# Altium project OneWireTC.PrjPcb
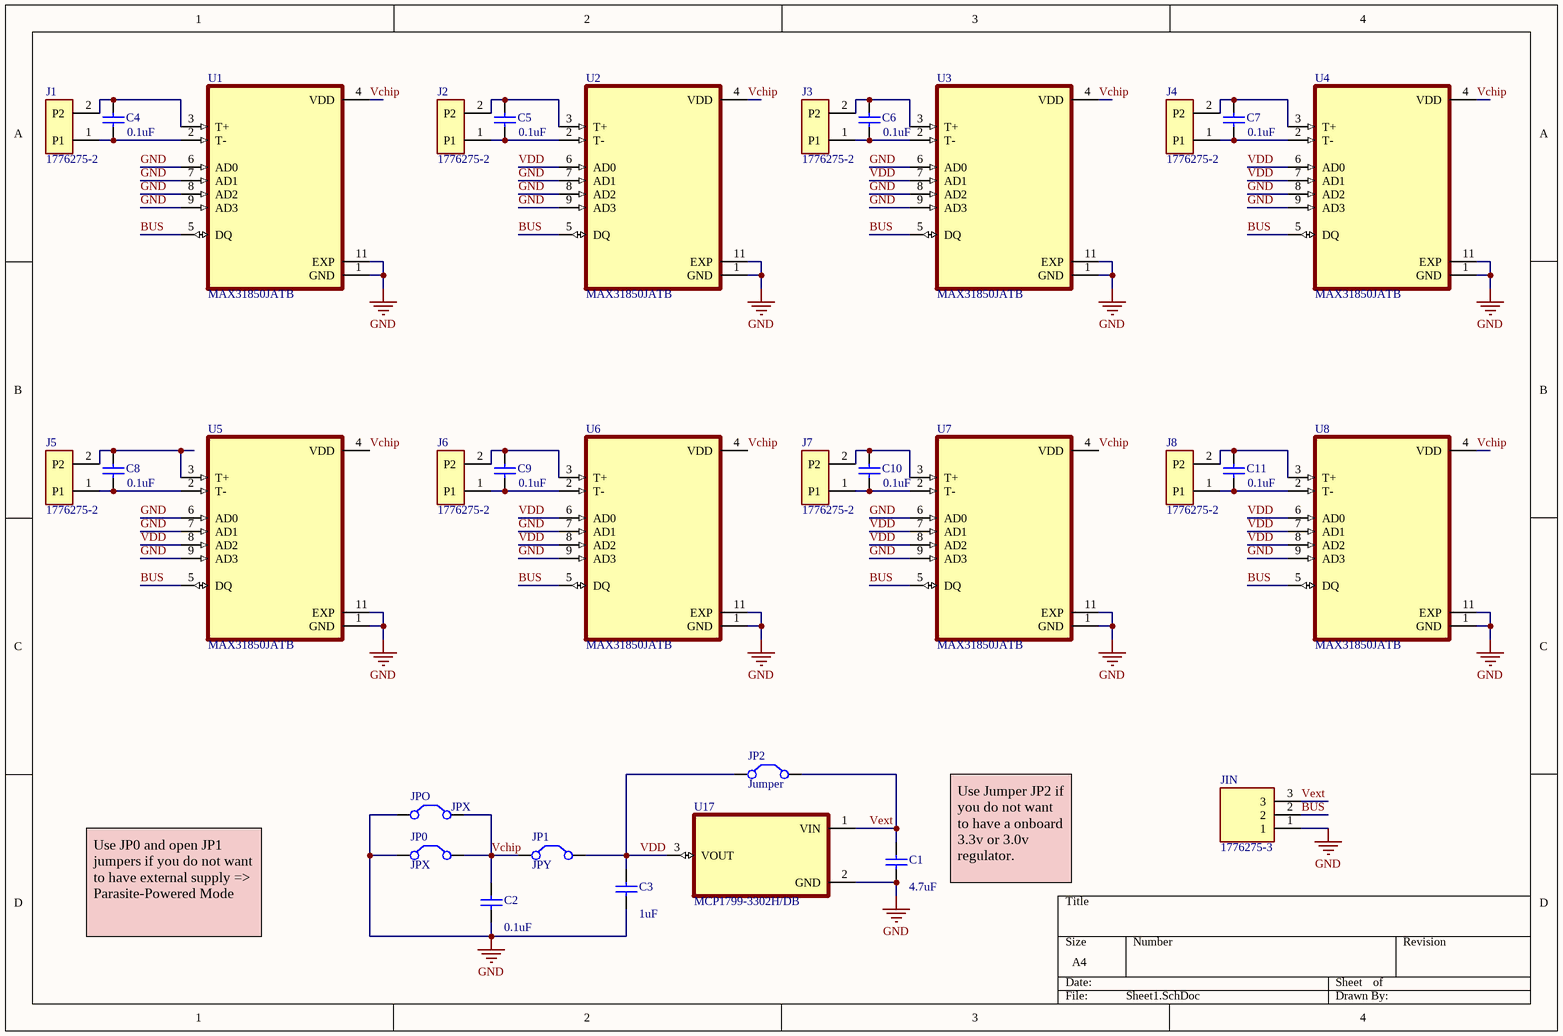
[diagram p0: Sheet1.SchDoc]
2 sheets, 57 parts. Net scope: global (net labels, ports and power ports of the same name join across sheets).
Board file: OneWireTC.PcbDoc
Sheets:
  Sheet1.SchDoc
  Sheet2.SchDoc

## Sheet Sheet1.SchDoc
size A4

### Parts
C1  value 4.7uF  [C0805]
C2  value 0.1uF  [1608[0603]]
C3  value 1uF  [1608[0603]]
C4  value 0.1uF  [1608[0603]]
C5  value 0.1uF  [1608[0603]]
C6  value 0.1uF  [1608[0603]]
C7  value 0.1uF  [1608[0603]]
C8  value 0.1uF  [1608[0603]]
C9  value 0.1uF  [1608[0603]]
C10  value 0.1uF  [1608[0603]]
C11  value 0.1uF  [1608[0603]]
J1  1776275-2  [TE_1776275-2]
J2  1776275-2  [TE_1776275-2]
J3  1776275-2  [TE_1776275-2]
J4  1776275-2  [TE_1776275-2]
J5  1776275-2  [TE_1776275-2]
J6  1776275-2  [TE_1776275-2]
J7  1776275-2  [TE_1776275-2]
J8  1776275-2  [TE_1776275-2]
JIN  1776275-3  [TE_1776275-3]
JP0  JPX  [1608[0603]]
JP1  JPY  [6-0805_L]
JP2  Jumper  [6-0805_L]
JPO  JPX  [1608[0603]]
U1  MAX31850JATB  [SON50P300X400X80-11N]
U2  MAX31850JATB  [SON50P300X400X80-11N]
U3  MAX31850JATB  [SON50P300X400X80-11N]
U4  MAX31850JATB  [SON50P300X400X80-11N]
U5  MAX31850JATB  [SON50P300X400X80-11N]
U6  MAX31850JATB  [SON50P300X400X80-11N]
U7  MAX31850JATB  [SON50P300X400X80-11N]
U8  MAX31850JATB  [SON50P300X400X80-11N]
U17  MCP1799-3302H/DB  [SOT230P700X180-4N]

### Nets
GND: C1.1 C2.1 C3.1 JIN.1 JP0.1(C1) JPO.1(C1) U1.1(GND) U1.6(AD0) U1.7(AD1) U1.8(AD2) U1.9(AD3) U1.11(EXP) U2.1(GND) U2.7(AD1) U2.8(AD2) U2.9(AD3) U2.11(EXP) U3.1(GND) U3.6(AD0) U3.8(AD2) U3.9(AD3) U3.11(EXP) U4.1(GND) U4.8(AD2) U4.9(AD3) U4.11(EXP) U5.1(GND) U5.6(AD0) U5.7(AD1) U5.9(AD3) U5.11(EXP) U6.1(GND) U6.7(AD1) U6.9(AD3) U6.11(EXP) U7.1(GND) U7.6(AD0) U7.9(AD3) U7.11(EXP) U8.1(GND) U8.9(AD3) U8.11(EXP) U17.2(GND)
BUS: JIN.2 U1.5(DQ) U2.5(DQ) U3.5(DQ) U4.5(DQ) U5.5(DQ) U6.5(DQ) U7.5(DQ) U8.5(DQ)
Vchip: C2.2 JP0.2(C2) JP1.1(C1) JPO.2(C2) U1.4(VDD) U2.4(VDD) U3.4(VDD) U4.4(VDD) U5.4(VDD) U6.4(VDD) U7.4(VDD) U8.4(VDD)
VDD: C3.2 JP1.2(C2) JP2.1(C1) U2.6(AD0) U3.7(AD1) U4.6(AD0) U4.7(AD1) U5.8(AD2) U6.6(AD0) U6.8(AD2) U7.7(AD1) U7.8(AD2) U8.6(AD0) U8.7(AD1) U8.8(AD2) U17.3(VOUT)
Vext: C1.2 JIN.3 JP2.2(C2) U17.1(VIN)
NetC4_1: C4.1 J1.1(P1) U1.2(T-)
NetC4_2: C4.2 J1.2(P2) U1.3(T+)
NetC5_1: C5.1 J2.1(P1) U2.2(T-)
NetC5_2: C5.2 J2.2(P2) U2.3(T+)
NetC6_1: C6.1 J3.1(P1) U3.2(T-)
NetC6_2: C6.2 J3.2(P2) U3.3(T+)
NetC7_1: C7.1 J4.1(P1) U4.2(T-)
NetC7_2: C7.2 J4.2(P2) U4.3(T+)
NetC8_1: C8.1 J5.1(P1) U5.2(T-)
NetC8_2: C8.2 J5.2(P2) U5.3(T+)
NetC9_1: C9.1 J6.1(P1) U6.2(T-)
NetC9_2: C9.2 J6.2(P2) U6.3(T+)
NetC10_1: C10.1 J7.1(P1) U7.2(T-)
NetC10_2: C10.2 J7.2(P2) U7.3(T+)
NetC11_1: C11.1 J8.1(P1) U8.2(T-)
NetC11_2: C11.2 J8.2(P2) U8.3(T+)

### Notes on the sheet
- Use Jumper JP2 if you do not want to have a onboard 3.3v or 3.0v regulator.
- Use JP0 and open JP1 jumpers if you do not want to have external supply => Parasite-Powered Mode

### Library data of the parts
C1-C11 = Cap Semi: Capacitor (Semiconductor SIM Model); Published: 8-Jun-2000; LatestRevisionDate: 29-May-2009; LatestRevisionNote: IPC-7351 Footprint Added.; PackageReference: C1206; Publisher: Altium Limited; PackageDescription: Chip Capacitor
J1-J8 = 1776275-2: TERM BLOCK 2POS SIDE ENT 3.5MM; MF: {'manufacturer': u'TE Connectivity'}; Value: *; MP: 1776275-2; Availability: Unavailable; Price: None; Package: None
JIN = 1776275-3: MF: {'manufacturer': u'TE Connectivity'}; Price: None; Value: *; Availability: Unavailable; Package: None; MP: 1776275-3
JP0-JP2 JPO = Jumper: Jumper Wire; Published: 24-Mar-1999; LatestRevisionDate: 17-Jul-2002; LatestRevisionNote: Re-released for DXP Platform.; PackageReference: RAD-0.2; Publisher: Altium Limited; PackageDescription: Radial Cap, Thru-Hole; 2 Leads; 0.2 in Pin Spacing
U1-U8 = MAX31850JATB: None; MF: {'manufacturer': u'Maxim Integrated'}; Value: *; MP: MAX31850JATB; Availability: Unavailable; Price: None; Package: None
U17 = AP2114H-3.3TRG1: MF: {'manufacturer': u'Diodes Inc.'}; Price: None; Availability: Unavailable; Value: *; MP: AP2114H-3.3TRG1; Package: None

## Sheet Sheet2.SchDoc
size A4
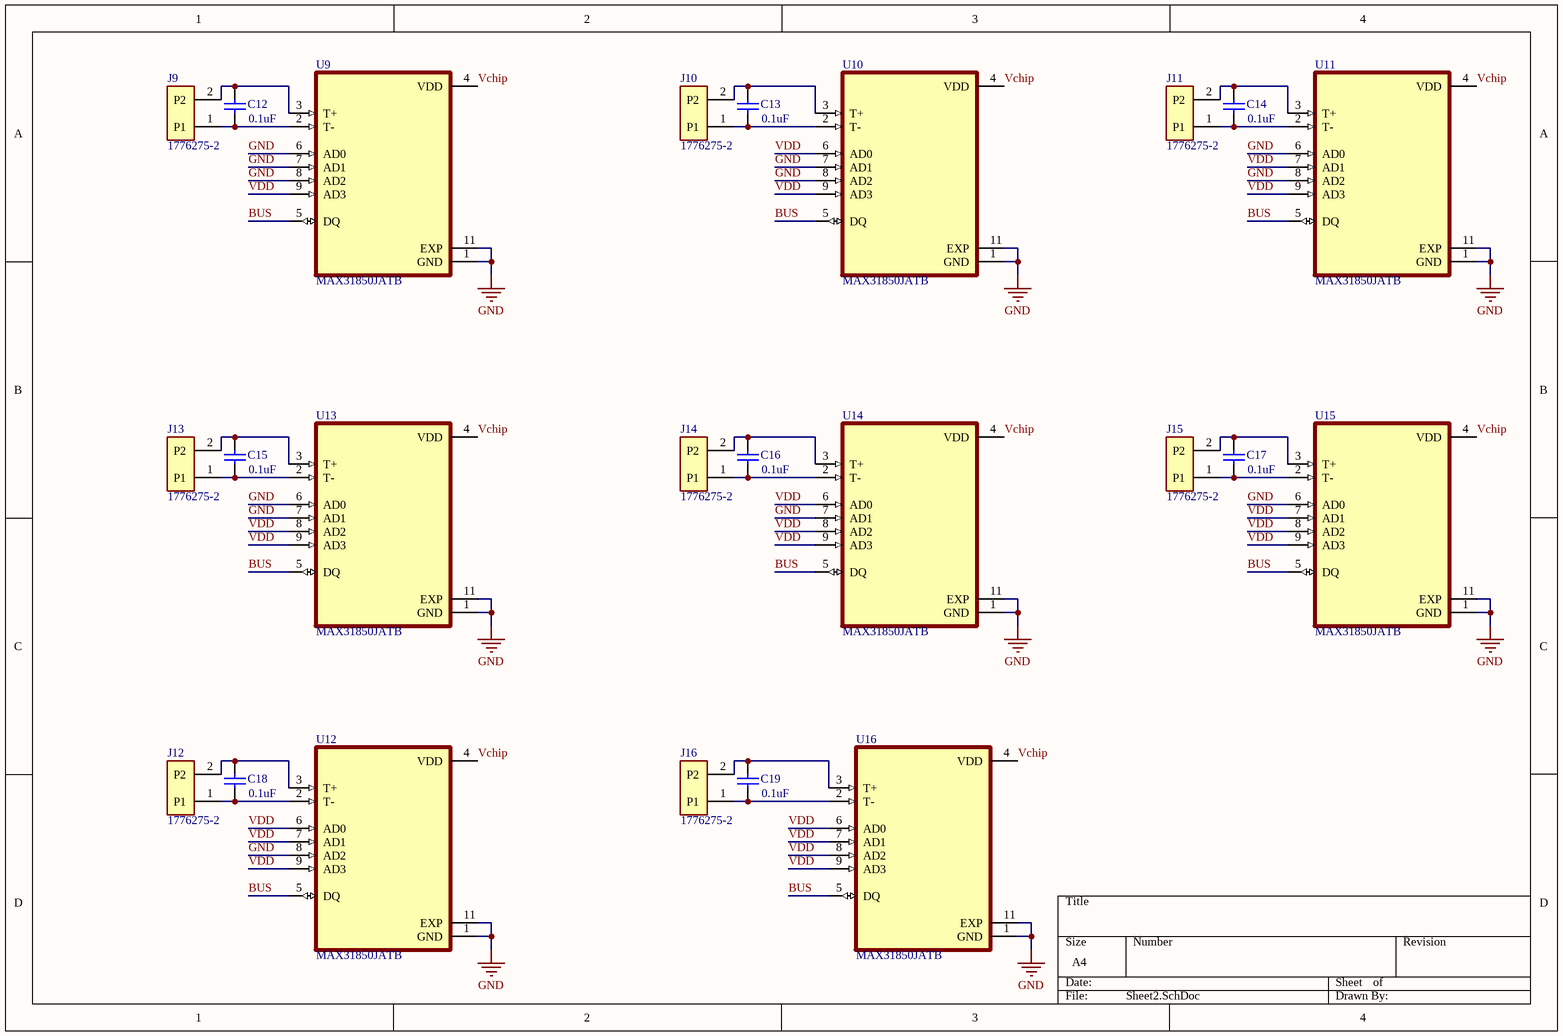
[diagram p1: Sheet2.SchDoc]

### Parts
C12  value 0.1uF  [1608[0603]]
C13  value 0.1uF  [1608[0603]]
C14  value 0.1uF  [1608[0603]]
C15  value 0.1uF  [1608[0603]]
C16  value 0.1uF  [1608[0603]]
C17  value 0.1uF  [1608[0603]]
C18  value 0.1uF  [1608[0603]]
C19  value 0.1uF  [1608[0603]]
J9  1776275-2  [TE_1776275-2]
J10  1776275-2  [TE_1776275-2]
J11  1776275-2  [TE_1776275-2]
J12  1776275-2  [TE_1776275-2]
J13  1776275-2  [TE_1776275-2]
J14  1776275-2  [TE_1776275-2]
J15  1776275-2  [TE_1776275-2]
J16  1776275-2  [TE_1776275-2]
U9  MAX31850JATB  [SON50P300X400X80-11N]
U10  MAX31850JATB  [SON50P300X400X80-11N]
U11  MAX31850JATB  [SON50P300X400X80-11N]
U12  MAX31850JATB  [SON50P300X400X80-11N]
U13  MAX31850JATB  [SON50P300X400X80-11N]
U14  MAX31850JATB  [SON50P300X400X80-11N]
U15  MAX31850JATB  [SON50P300X400X80-11N]
U16  MAX31850JATB  [SON50P300X400X80-11N]

### Nets
GND: U9.1(GND) U9.6(AD0) U9.7(AD1) U9.8(AD2) U9.11(EXP) U10.1(GND) U10.7(AD1) U10.8(AD2) U10.11(EXP) U11.1(GND) U11.6(AD0) U11.8(AD2) U11.11(EXP) U12.1(GND) U12.8(AD2) U12.11(EXP) U13.1(GND) U13.6(AD0) U13.7(AD1) U13.11(EXP) U14.1(GND) U14.7(AD1) U14.11(EXP) U15.1(GND) U15.6(AD0) U15.11(EXP) U16.1(GND) U16.11(EXP)
BUS: U9.5(DQ) U10.5(DQ) U11.5(DQ) U12.5(DQ) U13.5(DQ) U14.5(DQ) U15.5(DQ) U16.5(DQ)
Vchip: U9.4(VDD) U10.4(VDD) U11.4(VDD) U12.4(VDD) U13.4(VDD) U14.4(VDD) U15.4(VDD) U16.4(VDD)
VDD: U9.9(AD3) U10.6(AD0) U10.9(AD3) U11.7(AD1) U11.9(AD3) U12.6(AD0) U12.7(AD1) U12.9(AD3) U13.8(AD2) U13.9(AD3) U14.6(AD0) U14.8(AD2) U14.9(AD3) U15.7(AD1) U15.8(AD2) U15.9(AD3) U16.6(AD0) U16.7(AD1) U16.8(AD2) U16.9(AD3)
NetC12_1: C12.1 J9.1(P1) U9.2(T-)
NetC12_2: C12.2 J9.2(P2) U9.3(T+)
NetC13_1: C13.1 J10.1(P1) U10.2(T-)
NetC13_2: C13.2 J10.2(P2) U10.3(T+)
NetC14_1: C14.1 J11.1(P1) U11.2(T-)
NetC14_2: C14.2 J11.2(P2) U11.3(T+)
NetC15_1: C15.1 J13.1(P1) U13.2(T-)
NetC15_2: C15.2 J13.2(P2) U13.3(T+)
NetC16_1: C16.1 J14.1(P1) U14.2(T-)
NetC16_2: C16.2 J14.2(P2) U14.3(T+)
NetC17_1: C17.1 J15.1(P1) U15.2(T-)
NetC17_2: C17.2 J15.2(P2) U15.3(T+)
NetC18_1: C18.1 J12.1(P1) U12.2(T-)
NetC18_2: C18.2 J12.2(P2) U12.3(T+)
NetC19_1: C19.1 J16.1(P1) U16.2(T-)
NetC19_2: C19.2 J16.2(P2) U16.3(T+)

### Library data of the parts
C12-C19 = Cap Semi: Capacitor (Semiconductor SIM Model); Published: 8-Jun-2000; LatestRevisionDate: 29-May-2009; LatestRevisionNote: IPC-7351 Footprint Added.; PackageReference: C1206; Publisher: Altium Limited; PackageDescription: Chip Capacitor
J9-J16 = 1776275-2: as J1 on sheet Sheet1; Value: *; MP: 1776275-2; Availability: Unavailable; Price: None; Package: None
U9-U16 = MAX31850JATB: as U1 on sheet Sheet1; Value: *; MP: MAX31850JATB; Availability: Unavailable; Price: None; Package: None

## Nets that join several sheets
GND: Sheet1 (43 pins), Sheet2 (28 pins)
BUS: Sheet1 (9 pins), Sheet2 (8 pins)
Vchip: Sheet1 (12 pins), Sheet2 (8 pins)
VDD: Sheet1 (16 pins), Sheet2 (20 pins)